# Altium schematic sheet EEPROM.SchDoc
size A4; SheetNumber: 4; SheetTotal: 13
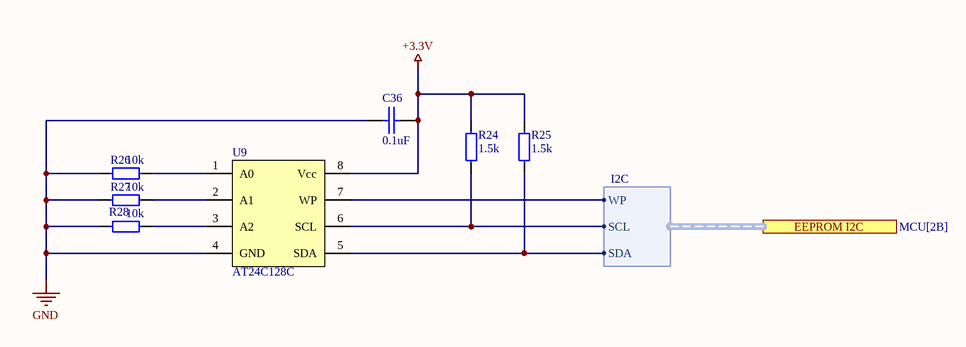
[diagram p0: EEPROM.SchDoc]

## Parts
C36  0.1uF  [0805 Capicator]
R24  1.5k  [0805 Resistor]
R25  1.5k  [0805 Resistor]
R26  10k  [0805 Resistor]
R27  10k  [0805 Resistor]
R28  10k  [0805 Resistor]
U9  AT24C128C  [SOIC-8]

## Ports
EEPROM I2C (harness I2C, see MCU[2B])

## Harnesses
I2C: WP, SCL, SDA

## Nets
+3.3V: C36.1 R24.2 R25.2 U9.8(Vcc)
GND: C36.2 R26.1 R27.1 R28.1 U9.4(GND)
NetR24_1: R24.1 U9.6(SCL) ; port EEPROM I2C.SCL
NetR25_1: R25.1 U9.5(SDA) ; port EEPROM I2C.SDA
NetR26_2: R26.2 U9.1(A0)
NetR27_2: R27.2 U9.2(A1)
NetR28_2: R28.2 U9.3(A2)
NetU9_7: U9.7(WP) ; port EEPROM I2C.WP

## Library data of the parts
C36 = Cap 0.1uF (0805): 0.1uF X7R 25V 10% 0805; Manufacturer: Murata Manufacturing; Part Number: GRM21BR71E104KA01L; Type: Capacitor; ComponentLink1Description: Chip&Dip; ComponentLink1URL: https://www.chipdip.ru/product/grm21br71e104ka01l
R24 R25 = Res 1.5k (0805): 0.125W 0805 1.5k, 1%; Part Number: RC0805FR-071K5L; Manufacturer: Taiwan; Type: Resistor; ComponentLink1Description: Chip&Dip; ComponentLink1URL: https://www.chipdip.ru/product0/9000079490
R26-R28 = Res 10k (0805): 0.125W 0805 10k, 1%; Part Number: RC0805FR-0710KL; Manufacturer: Taiwan; Type: Resistor; ComponentLink1Description: Chip&Dip; ComponentLink1URL: https://www.chipdip.ru/product0/9000079514
U9 = EEPROM AT24C128C: I2C-Compatible (2-Wire) Serial EEPROM 128-Kbit; Type: IC; ComponentLink1Description: Buy; ComponentLink1URL: https://radioremont.com/product/mikroskhema-at24c128c-k151-7/; ComponentLink2Description: Datasheet; ComponentLink2URL: https://radioremont.com/wa-data/public/shop/products/29/75/7529/attachments/AT24C128.pdf